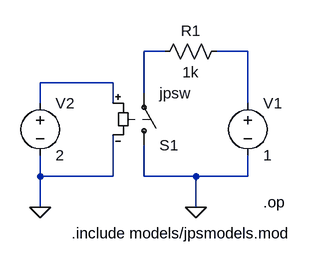
[diagram p0: schematic switch_example.asc]
switch_example.asc, the LTspice schematic file:
Version 4
SHEET 1 880 680
WIRE 224 48 192 48
WIRE 352 48 304 48
WIRE 144 96 32 96
WIRE 192 112 192 48
WIRE 32 128 32 96
WIRE 144 128 144 96
WIRE 352 128 352 48
WIRE 32 240 32 208
WIRE 144 240 144 176
WIRE 144 240 32 240
WIRE 192 240 192 192
WIRE 272 240 192 240
WIRE 352 240 352 208
WIRE 352 240 272 240
WIRE 32 288 32 240
WIRE 272 288 272 240
FLAG 272 288 0
FLAG 32 288 0
SYMBOL sw 192 208 M180
SYMATTR InstName S1
SYMATTR Value jpsw
SYMBOL voltage 352 112 R0
WINDOW 123 0 0 Left 2
WINDOW 39 0 0 Left 2
SYMATTR InstName V1
SYMATTR Value 1
SYMBOL res 208 64 R270
WINDOW 0 32 56 VTop 2
WINDOW 3 0 56 VBottom 2
SYMATTR InstName R1
SYMATTR Value 1k
SYMBOL voltage 32 112 R0
WINDOW 123 0 0 Left 2
WINDOW 39 0 0 Left 2
SYMATTR InstName V2
SYMATTR Value 2
TEXT 376 280 Left 2 !.op
TEXT 80 328 Left 2 !.include models/jpsmodels.mod

The netlist it stands for:
* switch_example.asc
S1 0 N001 N003 0 jpsw
V1 N002 0 1
R1 N001 N002 1k
V2 N003 0 2
.op
.include models/jpsmodels.mod
.backanno
.end